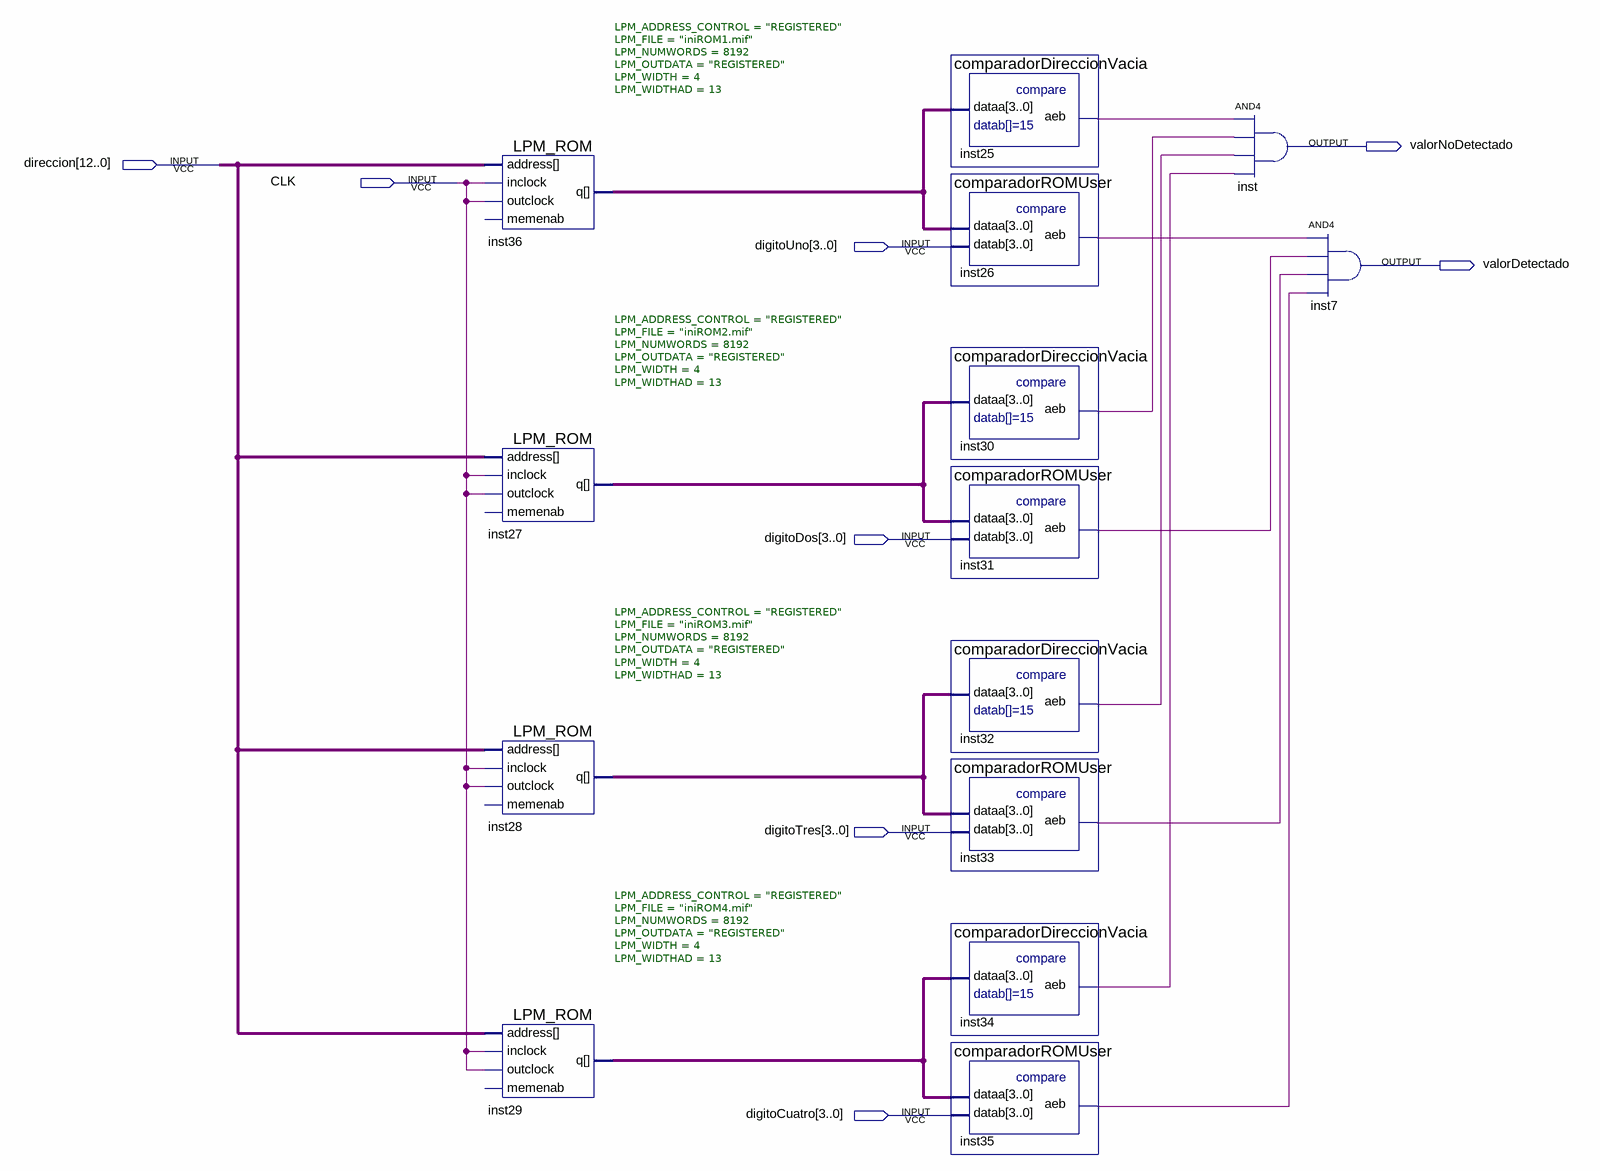
[diagram p0: schematic sheet]
// Quartus schematic ROM.bdf as structural Verilog: 14 symbols, 8 pins
module ROM (
  input  [12:0] direccion,
  input  CLK,
  input  [3:0] digitoUno,
  input  [3:0] digitoDos,
  input  [3:0] digitoTres,
  input  [3:0] digitoCuatro,
  output valorNoDetectado,
  output valorDetectado
);

  wire inst25_aeb, inst26_aeb, inst30_aeb, inst31_aeb, inst32_aeb, inst33_aeb, inst34_aeb, inst35_aeb;
  wire [3:0] inst27_q, inst28_q, inst29_q, inst36_q;

  LPM_ROM #(.LPM_ADDRESS_CONTROL("REGISTERED"), .LPM_FILE("iniROM1.mif"), .LPM_NUMWORDS(8192), .LPM_OUTDATA("REGISTERED"), .LPM_WIDTH(4), .LPM_WIDTHAD(13)) inst36 (
    .address(direccion), .inclock(CLK), .outclock(CLK), .q(inst36_q));  // open: memenab
  LPM_ROM #(.LPM_ADDRESS_CONTROL("REGISTERED"), .LPM_FILE("iniROM2.mif"), .LPM_NUMWORDS(8192), .LPM_OUTDATA("REGISTERED"), .LPM_WIDTH(4), .LPM_WIDTHAD(13)) inst27 (
    .address(direccion), .inclock(CLK), .outclock(CLK), .q(inst27_q));  // open: memenab
  LPM_ROM #(.LPM_ADDRESS_CONTROL("REGISTERED"), .LPM_FILE("iniROM3.mif"), .LPM_NUMWORDS(8192), .LPM_OUTDATA("REGISTERED"), .LPM_WIDTH(4), .LPM_WIDTHAD(13)) inst28 (
    .address(direccion), .inclock(CLK), .outclock(CLK), .q(inst28_q));  // open: memenab
  LPM_ROM #(.LPM_ADDRESS_CONTROL("REGISTERED"), .LPM_FILE("iniROM4.mif"), .LPM_NUMWORDS(8192), .LPM_OUTDATA("REGISTERED"), .LPM_WIDTH(4), .LPM_WIDTHAD(13)) inst29 (
    .address(direccion), .inclock(CLK), .outclock(CLK), .q(inst29_q));  // open: memenab
  comparadorDireccionVacia inst25 (.dataa(inst36_q), .aeb(inst25_aeb));
  comparadorROMUser inst26 (.dataa(inst36_q), .datab(digitoUno), .aeb(inst26_aeb));
  comparadorDireccionVacia inst30 (.dataa(inst27_q), .aeb(inst30_aeb));
  comparadorROMUser inst31 (.dataa(inst27_q), .datab(digitoDos), .aeb(inst31_aeb));
  comparadorDireccionVacia inst32 (.dataa(inst28_q), .aeb(inst32_aeb));
  comparadorROMUser inst33 (.dataa(inst28_q), .datab(digitoTres), .aeb(inst33_aeb));
  comparadorDireccionVacia inst34 (.dataa(inst29_q), .aeb(inst34_aeb));
  comparadorROMUser inst35 (.dataa(inst29_q), .datab(digitoCuatro), .aeb(inst35_aeb));
  and inst (valorNoDetectado, inst25_aeb, inst30_aeb, inst32_aeb, inst34_aeb);
  and inst7 (valorDetectado, inst26_aeb, inst31_aeb, inst33_aeb, inst35_aeb);
endmodule
